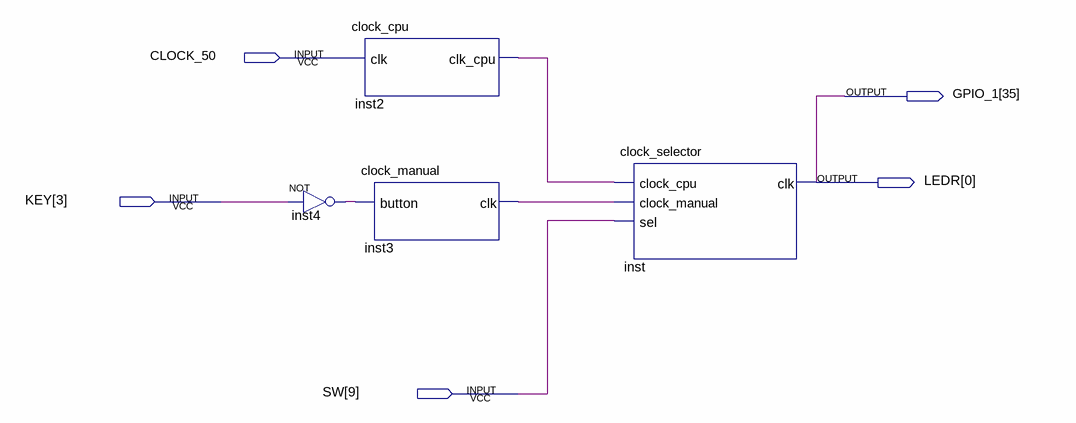
[diagram p0: schematic sheet]
// Quartus schematic project.bdf as structural Verilog: 4 symbols, 5 pins
module project (
  input  CLOCK_50,
  input  [3:3] KEY,
  input  [9:9] SW,
  output [35:35] GPIO_1,
  output [0:0] LEDR
);

  wire inst2_clk_cpu, inst3_clk, inst4_out;

  not inst4 (inst4_out, KEY[3]);
  clock_cpu inst2 (.clk(CLOCK_50), .clk_cpu(inst2_clk_cpu));
  clock_manual inst3 (.button(inst4_out), .clk(inst3_clk));
  clock_selector inst (.clock_cpu(inst2_clk_cpu), .clock_manual(inst3_clk), .sel(SW[9]), .clk(GPIO_1[35]));

  assign LEDR[0] = GPIO_1[35];
endmodule
